# EAGLE design ir_beacon_rev00 (EAGLE 9.7.0)
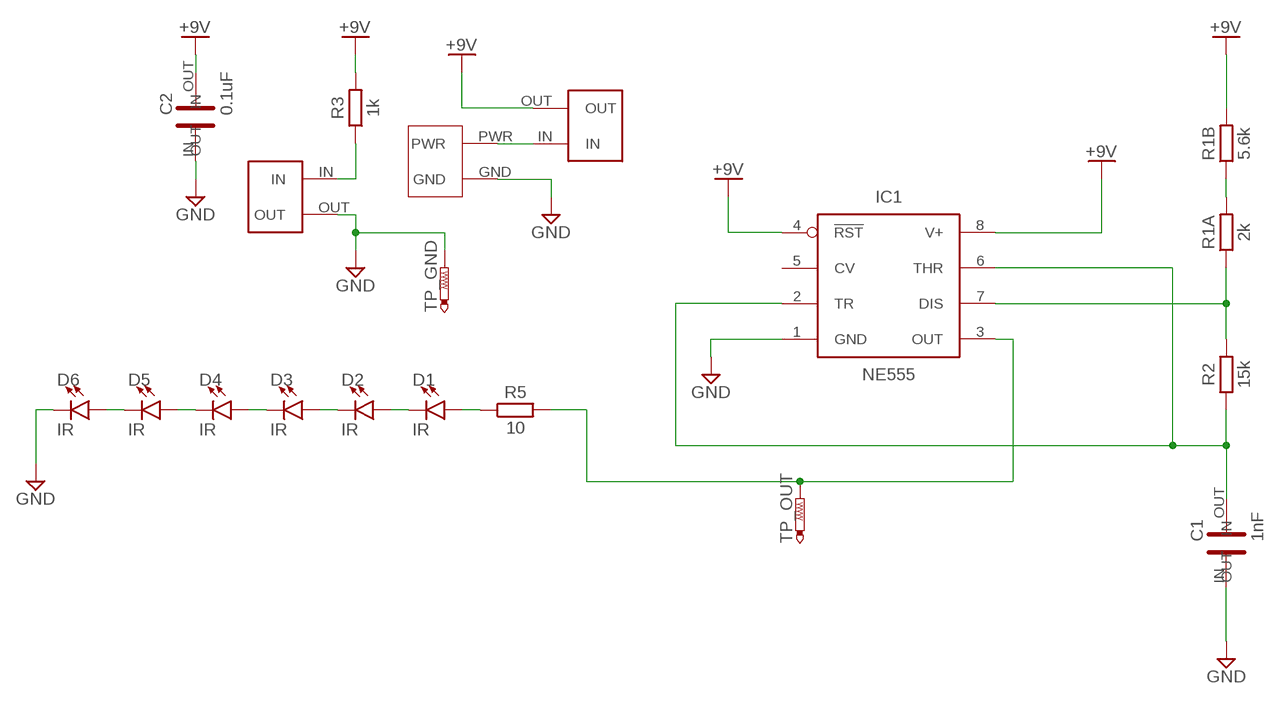
[diagram p0: schematic, sheet 1]

## Parts
BATT  JST_THRU_HOLE  [JST_THRU_HOLE]
C1  1nF  THRU_HOLE_CAP  [THRU_HOLE_CAP]
C2  0.1uF  THRU_HOLE_CAP  [THRU_HOLE_CAP]
D1  IR  LED-IRTSAL6100  [LED_5MM]
D2  IR  LED-IRTSAL6100  [LED_5MM]
D3  IR  LED-IRTSAL6100  [LED_5MM]
D4  IR  LED-IRTSAL6100  [LED_5MM]
D5  IR  LED-IRTSAL6100  [LED_5MM]
D6  IR  LED-IRTSAL6100  [LED_5MM]
IC1  NE555  ICM7555_DIP  [DIP826W53P254L959H508Q8B]
R1A  2k  R_AXIAL-11.7MM-PITCH  [RESAD1176W63L850D250B]
R1B  5.6k  R_AXIAL-11.7MM-PITCH  [RESAD1176W63L850D250B]
R2  15k  R_AXIAL-11.7MM-PITCH  [RESAD1176W63L850D250B]
R3  1k  R_AXIAL-11.7MM-PITCH  [RESAD1176W63L850D250B]
R5  10  R_AXIAL-11.7MM-PITCH  [RESAD1176W63L850D250B]
RED  LED  GEN_CONN  [GEN_CONN]
S1  GEN_CONN  [GEN_CONN]
TP_GND  PTR1B2,54  [B2,54]
TP_OUT  PTR1B2,54  [B2,54]

## Nets
+9V: C2.OUT IC1.4(!RST) IC1.8(V+) R1B.2 R3.2 S1.OUT
GND: BATT.GND C1.IN C2.IN D6.K(C) IC1.1(GND) RED.OUT TP_GND.TP
N$1: C1.OUT IC1.2(TR) IC1.6(THR) R2.1
N$2: IC1.7(DIS) R1A.1 R2.2
N$4: D1.A R5.1
N$5: D1.K(C) D2.A
N$6: D2.K(C) D3.A
N$7: D3.K(C) D4.A
N$8: D4.K(C) D5.A
N$9: D5.K(C) D6.A
N$10: R1A.2 R1B.1
N$11: IC1.3(OUT) R5.2 TP_OUT.TP
N$12: BATT.PWR S1.IN
N$13: R3.1 RED.IN
Unconnected: IC1.5(CV)

## Library data of the parts
BATT = matt_electronics_parts:JST_THRU_HOLE
C1 C2 = matt_electronics_parts:THRU_HOLE_CAP
D1-D6 = SparkFun-LED:LED-IR: Infrared LED (IR) Wavelength: 940nm Packages: TSAL6100 LTE302 - Side firing. Check SparkFun-Sensors.lbr for the receiver SparkFun Products: ZX Distance and Gesture Sensor <[https://www.sparkfun.com/products/12780]> Infrared Emitters and Detectors <https://www.sparkfun.com/products/241>; PROD_ID: DIO-12058
IC1 = IC_Clock-Timing:*555: TIMER 555 General purpose precision timers NE555 : Texas Datasheet <http://www.ti.com/general/docs/suppproductinfo.tsp?distId=10&gotoUrl=http%3A%2F%2Fwww.ti.com%2Flit%2Fgpn%2Fne555>, Diodes Incorporated Datasheet <https://www.diodes.com/assets/Datasheets/NE555_SA555_NA555.pdf> LM555 Datasheet <http://www.ti.com/general/docs/suppproductinfo.tsp?distId=10&gotoUrl=http%3A%2F%2Fwww.ti.com%2Flit%2Fgpn%2Flm555> LMC555 Datasheet <http://www.ti.com/general/docs/suppproductinfo.tsp?distId=10&gotoUrl=http%3A%2F%2Fwww.ti.com%2Flit%2Fgpn%2Flmc555> ICM7555 : Maxim Integrated Datasheet <https://datasheets.maximintegrated.com/en/ds/ICM7555-ICM7556.pdf>, Renesas Electronics America Inc Datasheet <https://www.renesas.com/en-us/www/doc/datasheet/icm7555-56.pdf>; CATEGORY: IC_Clock-Timing; CURRENT-SUPPLY: 60µA; DESCRIPTION: IC OSC SINGLE TIMER 1MHZ 8DIP; FREQUENCY: 1MHz; MANUFACTURER: Renesas Electronics America Inc; MPN: ICM7555IPAZ; OPERATING_TEMP: -25°C to 85°C; PART_STATUS: Active; ROHS_COMPLIANT: ROHS3 Compliant; SUB-CATEGORY: Timer
R1A R1B R2 R3 R5 = Resistor:R: Resistor Fixed - Generic; CATEGORY: Resistor; SUB-CATEGORY: Fixed
RED S1 = matt_electronics_parts:GEN_CONN
TP_GND TP_OUT = testpad:PTR1: TEST PIN

## Board
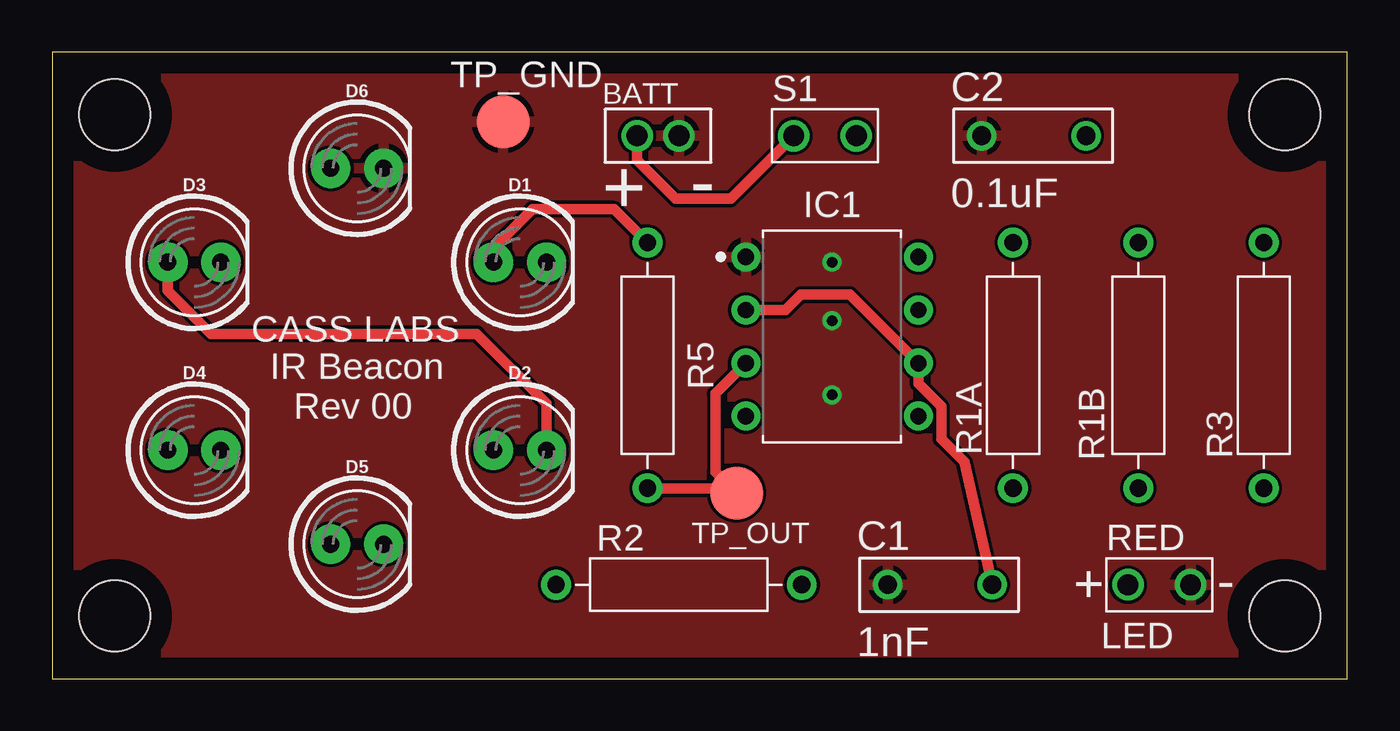
[diagram p1: board, top side]
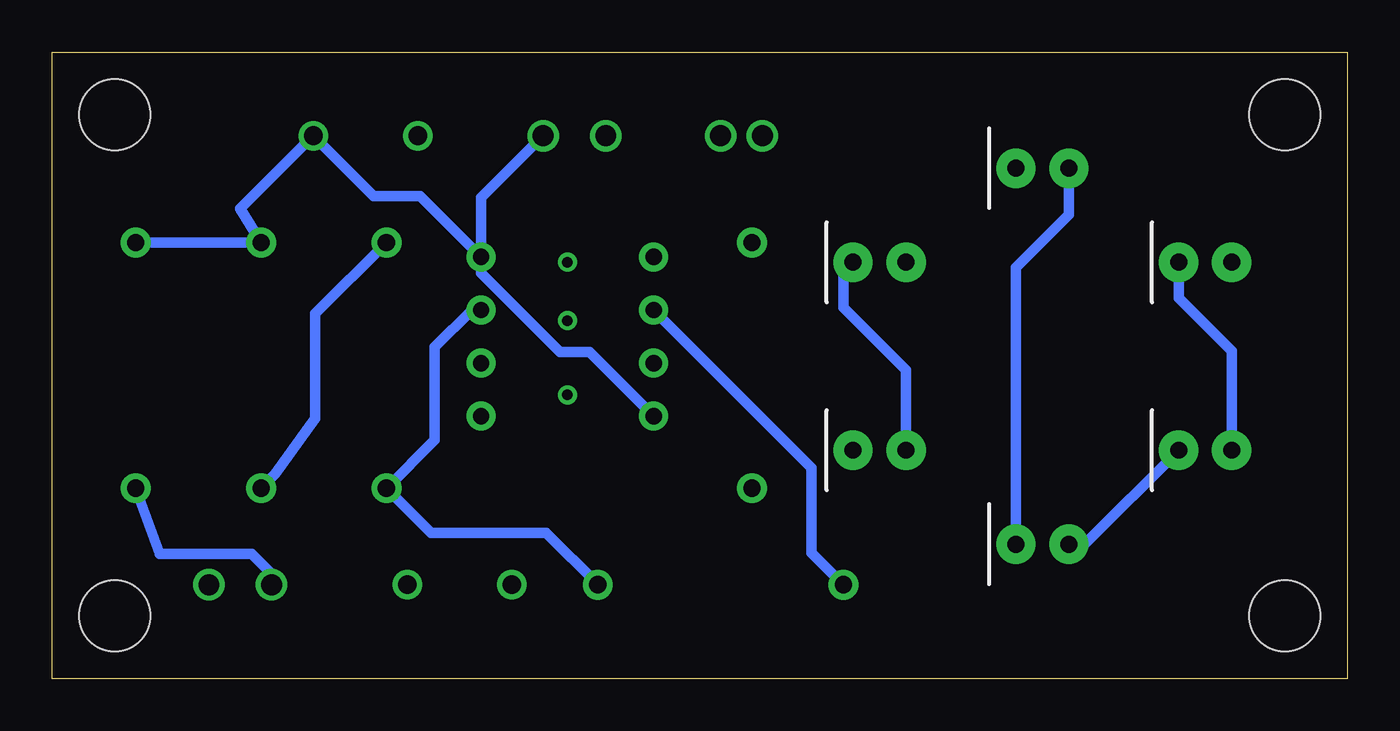
[diagram p2: board, bottom side, seen from below]

Size 62 x 30 mm. Coordinates in mm from the lower left corner, seen from the top.
Outline: 0,0 62,0 62,30 0,30 0,0
Copper layers (1*16): Top 0.035mm / dielectric 1.5mm / Bottom 0.035mm
Design rules "default": minimum track width 6mil, minimum drill 0.35mm, track to track 6mil, track to pad 6mil, pad to pad 6mil, via to via 6mil, smd to smd 6mil, copper to edge 40mil, drill to drill 6mil, minimum pad ring 10mil, minimum via ring 8mil, stop-mask expansion 4mil, vias tented up to drill 0mil, thermal gap 10mil
Holes 3.4 mm at 3,27 3,3 59,27 59,3

### Footprints (pad centres in the part's own frame; a part is rotated, then mirrored left to right if it is on the bottom)
JST_THRU_HOLE = drill 1: GND 1,0; PWR -1,0
THRU_HOLE_CAP = drill 0.9: IN -5,0; OUT 0,0
LED_5MM = drill 0.813 pad 1.88: A -1.27,0; K 1.27,0
DIP826W53P254L959H508Q8B = drill 0.786 pad 1.386: 1 -4.13,3.81; 2 -4.13,1.27; 3 -4.13,-1.27; 4 -4.13,-3.81; 5 4.13,-3.81; 6 4.13,-1.27; 7 4.13,1.27; 8 4.13,3.81
RESAD1176W63L850D250B = drill 0.83 pad 1.43: 1 -5.88,0; 2 5.88,0
GEN_CONN = drill 1: IN -1.5,0; OUT 1.5,0
B2,54 = smd 2.54 x 2.54: TP 0,0

### Placement (x,y rotation side)
BATT  29,26 0 top
C1  45,4.5 0 top
C2  49.5,26 0 top
D1  22.39,19.94 0 top
D2  22.39,10.94 0 top
D3  6.81,19.94 0 top
D4  6.81,10.94 0 top
D5  14.6,6.44 0 top
D6  14.6,24.44 0 top
IC1  37.34,16.38 0 top
R1A  46,15 90 top
R1B  52,15 90 top
R2  30,4.5 0 top
R3  58,15 90 top
R5  28.5,15 270 top
RED  53,4.5 0 top
S1  37,26 0 top
TP_GND  21.59,26.67 0 top
TP_OUT  32.77,8.89 0 top

### Tracks (layer width: path | path; a pad name or v marks a point on that pad's centre or on a via)
+9V
  Bottom 0.508: S1.OUT 41.47,23.03 IC1.8 | IC1.8 44.39,23.11 46.61,23.11 C2.OUT 53,22.5 R1B.2 R3.2 | IC1.4 36.28,15.65 37.69,15.65 41.47,19.42 IC1.8
GND  (via drill 0.5)
  other vias: 37.34,19.94 37.34,17.14 37.34,13.59
  pour Top: 0.25,0.25 61.75,0.25 61.75,29.75 0.25,29.75
N$1
  Top 0.508: C1.OUT 43.66,10.38 42.57,11.47 42.57,13.03 41.47,14.13 IC1.6 38.2,18.39 35.84,18.39 35.11,17.65 IC1.2
  Bottom 0.508: IC1.2 25.65,10.1 25.65,6.03 R2.1
N$2
  Bottom 0.508: R2.2 38.35,6.99 43.87,6.99 R1A.1 43.69,11.43 43.69,15.88 41.91,17.65 IC1.7
N$4
  Top 0.508: R5.1 26.9,22.48 22.99,22.48 21.12,20.62 D1.A
N$5
  Bottom 0.508: D2.A 21.12,14.77 24.13,17.78 24.13,19.47 D1.K
N$6
  Top 0.508: D2.K 23.66,13.17 20.32,16.51 7.62,16.51 5.54,18.59 D3.A
N$7
  Bottom 0.508: D4.A 5.54,15.7 8.08,18.24 D3.K
N$8
  Bottom 0.508: D4.K 12.58,6.44 D5.A
N$9
  Bottom 0.508: D5.K 15.87,19.69 13.33,22.23 D6.A
N$10
  Bottom 0.508: R1B.1 51.32,9.8 49.4,12.45 49.4,17.48 R1A.2
N$11
  Top 0.508: R5.2 32.54,9.12 TP_OUT.TP 31.75,9.91 31.75,13.65 IC1.3
N$12
  Top 0.508: BATT.PWR 28,24.83 29.84,22.99 32.49,22.99 S1.IN
N$13
  Bottom 0.508: R3.1 56.85,5.97 52.45,5.97 51.5,5.02 RED.IN

### Text on the board
tPlace: + | -
tNames: CASS LABS | IR Beacon | Rev 00